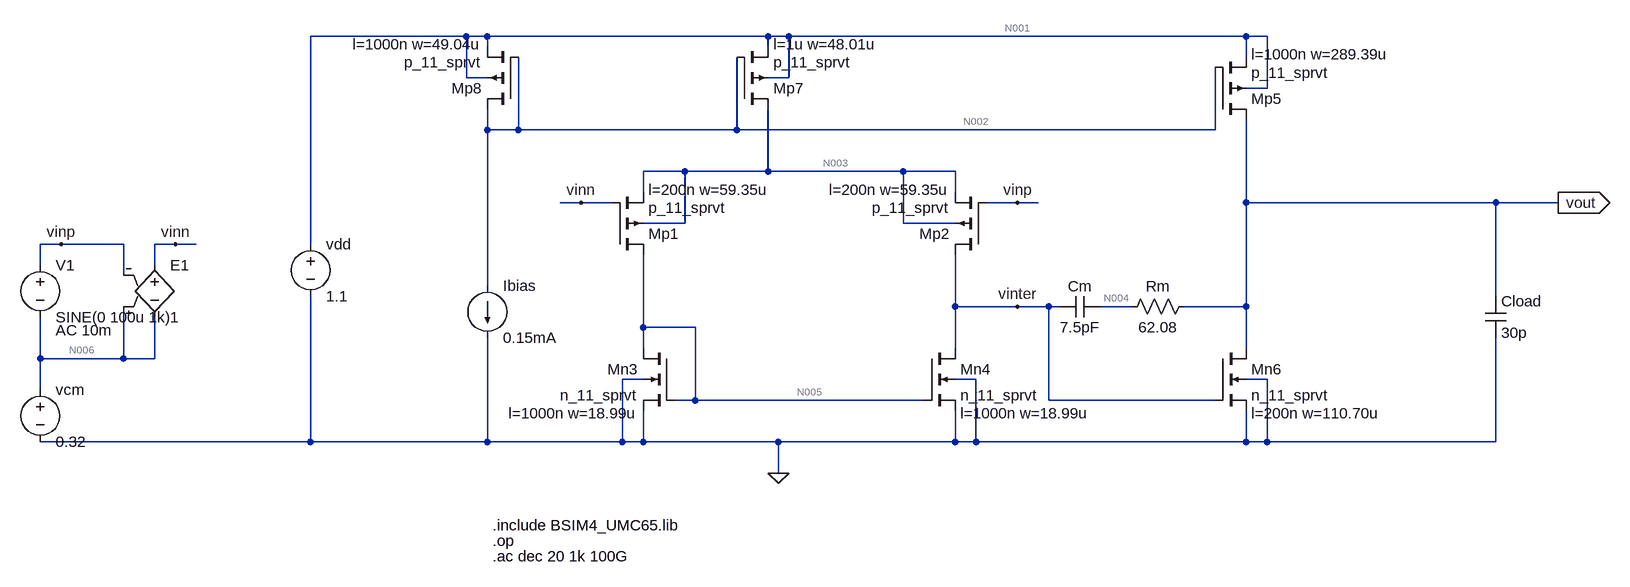
[diagram p0: schematic final_project.asc]
final_project.asc, the LTspice schematic file:
Version 4
SHEET 1 4000 1408
WIRE 2208 528 1968 528
WIRE 2240 528 2208 528
WIRE 2672 528 2240 528
WIRE 2704 528 2672 528
WIRE 3408 528 2704 528
WIRE 3440 528 3408 528
WIRE 2240 544 2240 528
WIRE 2672 544 2672 528
WIRE 3408 560 3408 528
WIRE 2208 592 2208 528
WIRE 2240 592 2208 592
WIRE 2704 592 2704 528
WIRE 2704 592 2672 592
WIRE 3440 608 3440 528
WIRE 3440 608 3408 608
WIRE 2240 672 2240 640
WIRE 2288 672 2288 560
WIRE 2288 672 2240 672
WIRE 2624 672 2624 560
WIRE 2624 672 2288 672
WIRE 3360 672 3360 576
WIRE 3360 672 2624 672
WIRE 2544 736 2480 736
WIRE 2672 736 2672 640
WIRE 2672 736 2544 736
WIRE 2880 736 2672 736
WIRE 2960 736 2880 736
WIRE 2480 768 2480 736
WIRE 2960 768 2960 736
WIRE 2384 784 2352 784
WIRE 2432 784 2384 784
WIRE 3056 784 3008 784
WIRE 3088 784 3056 784
WIRE 3408 784 3408 656
WIRE 3792 784 3408 784
WIRE 3888 784 3792 784
WIRE 2544 816 2544 736
WIRE 2544 816 2480 816
WIRE 2880 816 2880 736
WIRE 2960 816 2880 816
WIRE 1584 848 1552 848
WIRE 1680 848 1584 848
WIRE 1760 848 1728 848
WIRE 1792 848 1760 848
WIRE 1968 848 1968 528
WIRE 1552 880 1552 848
WIRE 1728 880 1728 848
WIRE 1680 896 1680 848
WIRE 2240 912 2240 672
WIRE 3792 928 3792 784
WIRE 2960 944 2960 864
WIRE 3056 944 2960 944
WIRE 3104 944 3056 944
WIRE 3120 944 3104 944
WIRE 3232 944 3184 944
WIRE 3408 944 3408 784
WIRE 3408 944 3312 944
WIRE 2480 976 2480 864
WIRE 2560 976 2480 976
WIRE 2480 1008 2480 976
WIRE 2960 1008 2960 944
WIRE 3408 1008 3408 944
WIRE 1552 1024 1552 960
WIRE 1680 1024 1680 944
WIRE 1680 1024 1552 1024
WIRE 1728 1024 1728 960
WIRE 1728 1024 1680 1024
WIRE 2480 1056 2448 1056
WIRE 2992 1056 2960 1056
WIRE 3440 1056 3408 1056
WIRE 1552 1072 1552 1024
WIRE 2560 1088 2560 976
WIRE 2560 1088 2528 1088
WIRE 2912 1088 2560 1088
WIRE 3104 1088 3104 944
WIRE 3360 1088 3104 1088
WIRE 1968 1152 1968 928
WIRE 1968 1152 1552 1152
WIRE 2240 1152 2240 992
WIRE 2240 1152 1968 1152
WIRE 2448 1152 2448 1056
WIRE 2448 1152 2240 1152
WIRE 2480 1152 2480 1104
WIRE 2480 1152 2448 1152
WIRE 2688 1152 2480 1152
WIRE 2960 1152 2960 1104
WIRE 2960 1152 2688 1152
WIRE 2992 1152 2992 1056
WIRE 2992 1152 2960 1152
WIRE 3408 1152 3408 1104
WIRE 3408 1152 2992 1152
WIRE 3440 1152 3440 1056
WIRE 3440 1152 3408 1152
WIRE 3792 1152 3792 992
WIRE 3792 1152 3440 1152
WIRE 2688 1200 2688 1152
FLAG 3888 784 vout
IOPIN 3888 784 Out
FLAG 1584 848 vinp
FLAG 1760 848 vinn
FLAG 2688 1200 0
FLAG 3056 784 vinp
FLAG 2384 784 vinn
FLAG 3056 944 vinter
SYMBOL voltage 1968 832 R0
WINDOW 123 0 0 Left 0
WINDOW 39 0 0 Left 0
SYMATTR InstName vdd
SYMATTR Value 1.1
SYMBOL voltage 1552 1056 R0
WINDOW 123 24 124 Left 2
WINDOW 39 0 0 Left 0
SYMATTR InstName vcm
SYMATTR Value 0.32
SYMBOL e2 1728 864 R0
SYMATTR InstName E1
SYMATTR Value 1
SYMBOL voltage 1552 864 R0
WINDOW 123 24 116 Left 2
WINDOW 39 0 0 Left 0
SYMATTR Value2 AC 10m
SYMATTR InstName V1
SYMATTR Value SINE(0 100u 1k)
SYMBOL pmos4 2288 640 R180
WINDOW 123 56 100 Left 2
SYMATTR Value2 l=1000n w=49.04u
SYMATTR InstName Mp8
SYMATTR Value p_11_sprvt
SYMBOL pmos4 2624 640 M180
WINDOW 123 56 100 Left 2
SYMATTR Value2 l=1u w=48.01u
SYMATTR InstName Mp7
SYMATTR Value p_11_sprvt
SYMBOL pmos4 2432 864 M180
WINDOW 123 56 100 Left 2
SYMATTR Value2 l=200n w=59.35u
SYMATTR InstName Mp1
SYMATTR Value p_11_sprvt
SYMBOL pmos4 3008 864 R180
WINDOW 123 56 100 Left 2
SYMATTR Value2 l=200n w=59.35u
SYMATTR InstName Mp2
SYMATTR Value p_11_sprvt
SYMBOL nmos4 2912 1008 R0
WINDOW 123 56 100 Left 2
SYMATTR Value2 l=1000n w=18.99u
SYMATTR InstName Mn4
SYMATTR Value n_11_sprvt
SYMBOL nmos4 2528 1008 M0
WINDOW 123 56 100 Left 2
SYMATTR Value2 l=1000n w=18.99u
SYMATTR InstName Mn3
SYMATTR Value n_11_sprvt
SYMBOL nmos4 3360 1008 R0
WINDOW 123 56 100 Left 2
SYMATTR Value2 l=200n w=110.70u
SYMATTR InstName Mn6
SYMATTR Value n_11_sprvt
SYMBOL pmos4 3360 656 M180
WINDOW 123 56 100 Left 2
SYMATTR Value2 l=1000n w=289.39u
SYMATTR InstName Mp5
SYMATTR Value p_11_sprvt
SYMBOL res 3328 928 R90
WINDOW 0 0 56 VBottom 2
WINDOW 3 32 56 VTop 2
SYMATTR InstName Rm
SYMATTR Value 62.08
SYMBOL cap 3184 928 R90
WINDOW 0 0 32 VBottom 2
WINDOW 3 32 32 VTop 2
SYMATTR InstName Cm
SYMATTR Value 7.5pF
SYMBOL current 2240 912 R0
WINDOW 123 0 0 Left 0
WINDOW 39 0 0 Left 0
SYMATTR InstName Ibias
SYMATTR Value 0.15mA
SYMBOL cap 3776 928 R0
SYMATTR InstName Cload
SYMATTR Value 30p
TEXT 2248 1280 Left 2 !.include BSIM4_UMC65.lib
TEXT 2248 1304 Left 2 !.op
TEXT 2248 1328 Left 2 !.ac dec 20 1k 100G

The netlist it stands for:
* final_project.asc
vdd N001 0 1.1
vcm N006 0 0.32
E1 vinn N006 N006 vinp 1
V1 vinp N006 SINE(0 100u 1k) AC 10m
Mp8 N002 N002 N001 N001 p_11_sprvt l=1000n w=49.04u
Mp7 N003 N002 N001 N001 p_11_sprvt l=1u w=48.01u
Mp1 N005 vinn N003 N003 p_11_sprvt l=200n w=59.35u
Mp2 vinter vinp N003 N003 p_11_sprvt l=200n w=59.35u
Mn4 vinter N005 0 0 n_11_sprvt l=1000n w=18.99u
Mn3 N005 N005 0 0 n_11_sprvt l=1000n w=18.99u
Mn6 vout vinter 0 0 n_11_sprvt l=200n w=110.70u
Mp5 vout N002 N001 N001 p_11_sprvt l=1000n w=289.39u
Rm vout N004 62.08
Cm N004 vinter 7.5pF
Ibias N002 0 0.15mA
Cload vout 0 30p
.model NMOS NMOS
.model PMOS PMOS
.lib standard.mos
.include BSIM4_UMC65.lib
.op
.ac dec 20 1k 100G
.backanno
.end

* Results of the author's LTspice run, read from the files saved beside the schematic
* Operating Point:
*   V(n001) = 1.1 V
*   V(n006) = 320 mV
*   V(vinn) = 320 mV
*   V(vinp) = 320 mV
*   V(n002) = 689.3 mV
*   V(n003) = 596.6 mV
*   V(n005) = 294.4 mV
*   V(vinter) = 294.6 mV
*   V(vout) = 270.2 mV
*   V(n004) = 270.2 mV
*   Id(Mn6) = 963.5 µA
*   Ig(Mn6) = 19.79 nA
*   Ib(Mn6) = -270.2 fA
*   Is(Mn6) = -963.5 µA
*   Id(Mn3) = 74.97 µA
*   Ig(Mn3) = 21.31 nA
*   Ib(Mn3) = -294.4 fA
*   Is(Mn3) = -74.99 µA
*   Id(Mn4) = 74.98 µA
*   Ig(Mn4) = 21.31 nA
*   Ib(Mn4) = -294.6 fA
*   Is(Mn4) = -75 µA
*   Id(Mp5) = -963.5 µA
*   Ig(Mp5) = -337.4 nA
*   Ib(Mp5) = 180.6 pA
*   Is(Mp5) = 963.8 µA
*   Id(Mp2) = -75 µA
*   Ig(Mp2) = -4.212 nA
*   Ib(Mp2) = 10.02 pA
*   Is(Mp2) = 75 µA
*   Id(Mp1) = -75.01 µA
*   Ig(Mp1) = -4.211 nA
*   Ib(Mp1) = 10.02 pA
*   Is(Mp1) = 75.02 µA
*   Id(Mp7) = -150 µA
*   Ig(Mp7) = -57.13 nA
*   Ib(Mp7) = 30.26 pA
*   Is(Mp7) = 150.1 µA
*   Id(Mp8) = -149.5 µA
*   Ig(Mp8) = -58.76 nA
*   Ib(Mp8) = 30.81 pA
*   Is(Mp8) = 149.6 µA
*   I(Cload) = 0 A
*   I(Cm) = 0 A
*   I(Ibias) = 150 µA
*   I(Rm) = 0 A
*   I(E1) = 4.211 nA
*   I(V1) = 4.212 nA
*   I(Vcm) = 8.423 nA
*   I(Vdd) = -1.263 mA
* From the log:
*   Semiconductor Device Operating Points:
*                           --- BSIM4 MOSFETS ---
*   Name:      mn6         mn3         mn4         mp5         mp2
*   Model: n_11_sprvt  n_11_sprvt  n_11_sprvt  p_11_sprvt  p_11_sprvt
*   Id:      9.63e-04    7.50e-05    7.50e-05   -9.63e-04   -7.50e-05
*   Vgs:     2.95e-01    2.94e-01    2.94e-01   -4.11e-01   -2.77e-01
*   Vds:     2.70e-01    2.94e-01    2.95e-01   -8.30e-01   -3.02e-01
*   Vbs:     0.00e+00    0.00e+00    0.00e+00    0.00e+00    0.00e+00
*   Vth:     1.81e-01    7.67e-02    7.67e-02   -2.11e-01   -2.78e-01
*   Vdsat:   8.24e-02    1.15e-01    1.15e-01   -1.79e-01   -6.89e-02
*   Gm:      1.73e-02    1.02e-03    1.02e-03    7.95e-03    1.41e-03
*   Gds:     6.60e-04    3.77e-05    3.77e-05    1.49e-04    5.58e-05
*   Gmb      1.32e-03    6.33e-05    6.33e-05    7.12e-04    1.08e-04
*   Cbd:     4.54e-14    7.71e-15    7.71e-15    8.53e-14    2.31e-14
*   Cbs:     5.11e-14    8.78e-15    8.78e-15    1.47e-13    3.02e-14
*   Name:      mp1         mp7         mp8
*   Model: p_11_sprvt  p_11_sprvt  p_11_sprvt
*   Id:     -7.50e-05   -1.50e-04   -1.50e-04
*   Vgs:    -2.77e-01   -4.11e-01   -4.11e-01
*   Vds:    -3.02e-01   -5.03e-01   -4.11e-01
*   Vbs:     0.00e+00    0.00e+00    0.00e+00
*   Vth:    -2.78e-01   -2.07e-01   -2.07e-01
*   Vdsat:  -6.89e-02   -1.81e-01   -1.82e-01
*   Gm:      1.41e-03    1.24e-03    1.24e-03
*   Gds:     5.57e-05    3.52e-05    4.53e-05
*   Gmb      1.08e-04    1.10e-04    1.09e-04
*   Cbd:     2.31e-14    1.65e-14    1.78e-14
*   Cbs:     3.02e-14    2.44e-14    2.49e-14